# Altium project CW330_NewKintexFPGA.PrjPcb (part 2 of 5)

## Sheet CW340_PSU_VCCAUX.SchDoc: VCC-AUX/VCC-IO SMPS
size Letter; Organization: NewAE Technology Inc.; Address1: 1083 Queen St., Suite 196; Address2: Halifax; Address3: NS; Address4: Canada B3H 0B2; DocumentNumber: .; Revision: .; SheetNumber: 21; SheetTotal: 31; SheetApproved: YES
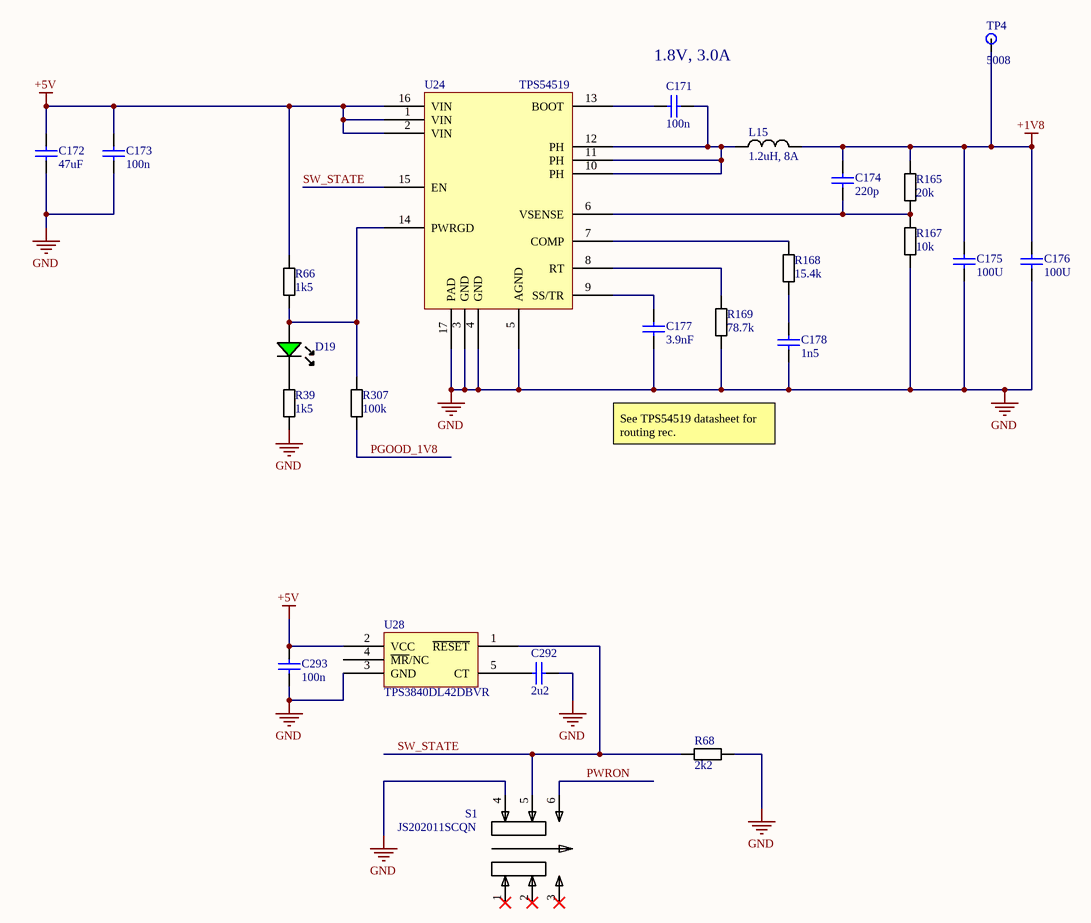
[diagram p8: CW340_PSU_VCCAUX.SchDoc]

### Parts
C171  100n  [CAPC0603_M]
C172  47uF  [CAPC3225X20N]
C173  100n  [CAPC0603_M]
C174  220p  [RESC1608X55N]
C175  100U  [CAPC1206_M]
C176  100U  [CAPC1206_M]
C177  3.9nF  [CAPC0603_M]
C178  1n5  [RESC1608X55N]
C292  2u2  [CAPC0603_M]
C293  100n  [CAPC0603_M]
D19  LED, 0603, Green  [LED-0603-GREEN]  (value not drawn)
L15  1.2uH, 8A  [XAL5030-122]
R39  1k5  [RESC1608X55N]
R66  1k5  [RESC1608X55N]
R68  2k2  [RESC1608X55N]
R165  20k  [RESC1608X55N]
R167  10k  [RESC1608X55N]
R168  15.4k  [RESC1608X55N]
R169  78.7k  [RESC1608X55N]
R307  100k  [RESC1608X55N]
S1  JS202011SCQN  [SW_JS202011SCQN]
TP4  5008  [KEYSTONE5008]
U24  TPS54519  [QFN50P300X300X80_HS-17N]
U28  TPS3840DL42DBVR  [SOT23-5P95_285X145L45X40]

### Nets
+1V8: C174.1 C175.1 C176.1 L15.2 R165.1 TP4.1
+5V: C172.1 C173.2 C293.2 R66.2 U24.1(VIN) U24.2(VIN) U24.16(VIN) U28.2(VCC)
GND: C172.2 C173.1 C175.2 C176.2 C177.2 C178.2 C292.2 C293.1 R39.2 R68.2 R167.2 R169.2 S1.4 U24.3(GND) U24.4(GND) U24.5(AGND) U24.17(PAD) U28.3(GND)
PGOOD_1V8: R307.2
PWRON: S1.6
SW_STATE: R68.1 S1.5 U24.15(EN) U28.1(~{RESET})
NetC171_1: C171.1 U24.13(BOOT)
NetC171_2: C171.2 L15.1 U24.10(PH) U24.11(PH) U24.12(PH)
NetC174_2: C174.2 R165.2 R167.1 U24.6(VSENSE)
NetC177_1: C177.1 U24.9(SS/TR)
NetC178_1: C178.1 R168.2
NetC292_1: C292.1 U28.5(CT)
NetD19_A: D19.A R66.1 R307.1 U24.14(PWRGD)
NetD19_K: D19.K R39.1
NetR168_1: R168.1 U24.7(COMP)
NetR169_1: R169.1 U24.8(RT)

Not connected (* = marked no-connect by the designer): S1 1* 2* 3*; U28 4(~{MR}/NC)

### Notes on the sheet
- (near C171) 1.8V, 3.0A
- See TPS54519 datasheet for routing rec.
- Title:
- Date:
- Rev:
- Time:
- Project:
- Sheet
- of
- License:
- Copyright © NewAE Technology Inc.
- Approved:
- NewAE.com
- File:

### Library data of the parts
C171 C173 C293 = CCHIP-100n-0603: 100n, 0603; Manufacture 1: Kemet; Manufacture Part Number 1: C0603C104K5RACTU; Component Group: Capacitor; Case-EIA: 0603; Case-Metric: 1608; Rated Voltage: 50VDC; Part Number: CCHIP-100n-0603; Footprint: 0603; Pin Count: 2; Supplier 1: Digi-Key; Supplier Part Number 1: 399-5089-2-ND; Value: 100n; Mounting Technology: SMT; Component Kind: Standard; Component Type: Standard
  C171 C173: LCSC Equivalent: C1591
C172 = CCHIP-47u-1210: 47u, 10V, 1210, Ceramic; Manufacture 1: TDK Corporation; Manufacture Part Number 1: C3225X5R1A476M250AC; Component Group: Capacitor; Case-EIA: 1210; Case-Metric: 3225; Rated Voltage: 10VDC; Tolerance: 20%; Part Number: CCHIP-47u-1210; Footprint: 1210; Pin Count: 2; Supplier 1: Digi-Key; Supplier Part Number 1: 445-6711-1-ND; Value: 47uF; Mounting Technology: SMT; Temperature Range: -55C to 85C; Component Kind: Standard; Component Type: Standard
C174 = CCHIP-220P-0603-250V: CAP CER 220PF 250V X7R 0603; Manufacture 1: Murata Electronics North America; Manufacture Part Number 1: GRM188R72E221KW07D; Component Group: Capacitor; Case-EIA: 0603; Case-Metric: 1608; Tolerance: ±10%; PP Material Stack: 0; Part Number: CCHIP-220P-0603-250V; Footprint: 0603; Pin Count: 2; Supplier 1: Digi-Key; Supplier Part Number 1: 490-3521-1-ND; Value: 220p; Rated Voltage: 250V; Mounting Technology: SMT; Component Kind: Standard; Component Type: Standard; PP Rotation: 0
C175 C176 = CCHIP-100u-1206-6.3v: CAP CER 100UF 6.3V X5R 1206; Manufacture 1: Murata Electronics; Manufacture Part Number 1: GRM31CR60J107ME39L; Component Group: Capacitor; Case-EIA: 1206; Case-Metric: 3216; Rated Voltage: 6.3VDC; Part Number: CCHIP-100u-1206-6.3v; Footprint: 1206; Pin Count: 2; Supplier 1: Digi-Key; Supplier Part Number 1: 490-4539-2-ND; Value: 100U; Mounting Technology: SMT; Component Kind: Standard; Component Type: Standard
C177 = CCHIP-3n9-0603: 3n9, 0603; Manufacture 1: Murata; Manufacture Part Number 1: GCM1885C1H392FA16J; Component Group: Capacitor; Case-EIA: 0603; Case-Metric: 1608; PP Material Stack: 0; Tolerance: 1%; Part Number: CCHIP-3n9-0603; Footprint: 0603; Pin Count: 2; Value: 3.9nF; Mounting Technology: SMT; Component Kind: Standard; Component Type: Standard; PP Rotation: 0; Supplier 1: Digi-Key; Supplier Part Number 1: 490-GCM1885C1H392FA16JCT-ND
C178 = CCHIP-1N5-0603-100V: CAP CER 1500PF 100V X7R 0603; Manufacture 1: Murata Electronics North America; Manufacture Part Number 1: GRM188R72A152KA01D; Component Group: Capacitor; Case-EIA: 0603; Case-Metric: 1608; Tolerance: ±10%; PP Material Stack: 0; Part Number: CCHIP-1N5-0603-100V; Footprint: 0603; Pin Count: 2; Supplier 1: Digi-Key; Supplier Part Number 1: 490-1475-1-ND; Value: 1n5; Rated Voltage: 100V; Mounting Technology: SMT; Component Kind: Standard; Component Type: Standard; PP Rotation: 0
C292 = CCHIP-2u2-0603: as C9 on sheet CW340_HEATSINK_FAN; Part Number: CCHIP-2u2-0603; Footprint: 0603; Pin Count: 2; Supplier 1: Digi-Key; Value: 2u2; Mounting Technology: SMT; Component Kind: Standard; Component Type: Standard; Supplier Part Number 1: 1276-1134-1-ND
D19 = LEDCHIP_0603_GREEN: Chip LED, Green; Manufacture 1: Kingbright; Manufacture Part Number 1: APT1608CGCK; Component Group: Optical; PP Material Stack: 16; PP Rotation: -90; Part Number: LEDCHIP_0603_GREEN; Pin Count: 2; Supplier 1: Digi-Key; Supplier Part Number 1: 754-1116-1-ND; Mounting Technology: SMT; Component Kind: Standard; Component Type: Standard
L15 = XAL5030-122: 1.2uH, 8A RMS, 12A SAT; Manufacture 1: Coilcraft; Manufacture Part Number 1: XAL5030-122MEB; Component Group: Inductor; PP Material Stack: 0; Part Number: XAL5030-122; Footprint: XAL5030; Pin Count: 2; Supplier 1: Mouser; Value: 1.2uH, 8A; Mounting Technology: SMT; Component Kind: Standard; Component Type: Standard; PP Rotation: 0
R39 R66 = RCHIP-1K5-0603: 1k5 res, 0603, 1%, 1/10W; Manufacture 1: Yageo; Manufacture Part Number 1: RC0603FR-071K5L; Component Group: Resistor; Case-EIA: 0603; Case-Metric: 1608; Rated Power: 0.1W; Rated Voltage: 75VDC; Part Number: RCHIP-1K5-0603; Footprint: 0603; Pin Count: 2; Supplier 1: Digi-Key; Supplier Part Number 1: 311-1.50KHRCT-ND; Value: 1k5; Tolerance: 1%; Mounting Technology: SMT; Temperature Range: -55C to 155C; Component Kind: Standard; Component Type: Standard
R68 = RCHIP-2K2-0603: 2k2 res, 0603, 1%, 1/10W; Manufacture 1: Yageo; Manufacture Part Number 1: RC0603FR-072K2L; Component Group: Resistor; Case-EIA: 0603; Case-Metric: 1608; Rated Power: 0.1W; Rated Voltage: 75VDC; Part Number: RCHIP-2K2-0603; Footprint: 0603; Pin Count: 2; Supplier 1: Digi-Key; Supplier Part Number 1: 311-2.20KHRCT-ND; Value: 2k2; Tolerance: 1%; Mounting Technology: SMT; Temperature Range: -55C to 155C; Component Kind: Standard; Component Type: Standard
R165 = RCHIP-20K-0603: 20k res, 0603, 1%, 1/10W; Manufacture 1: Yageo; Manufacture Part Number 1: RC0603FR-0720KL; Component Group: Resistor; Case-EIA: 0603; Case-Metric: 1608; Rated Power: 0.1W; Rated Voltage: 75VDC; Part Number: RCHIP-20K-0603; Footprint: 0603; Pin Count: 2; Supplier 1: Digi-Key; Supplier Part Number 1: 311-20.0KHRCT-ND; Value: 20k; Tolerance: 1%; Mounting Technology: SMT; Temperature Range: -55C to 155C; Component Kind: Standard; Component Type: Standard
R167 = RCHIP-10K-0603: 10k res, 0603, 1%, 1/10W; Manufacture 1: Yageo; Manufacture Part Number 1: RC0603FR-0710KL; Component Group: Resistor; Case-EIA: 0603; Case-Metric: 1608; Rated Power: 0.1W; Rated Voltage: 75VDC; Part Number: RCHIP-10K-0603; Footprint: 0603; Pin Count: 2; Supplier 1: Digi-Key; Supplier Part Number 1: 311-10.0KHRCT-ND; Value: 10k; Tolerance: 1%; Mounting Technology: SMT; Temperature Range: -55C to 155C; Component Kind: Standard; Component Type: Standard
R168 = RCHIP-15k4-0603: 15k4 res, 0603, 1%, 1/10W; Manufacture 1: Yageo; Manufacture Part Number 1: RC0603FR-0715K4L; Component Group: Resistor; Case-EIA: 0603; Case-Metric: 1608; Rated Power: 0.1W; Rated Voltage: 75VDC; Part Number: RCHIP-15k4-0603; Footprint: 0603; Pin Count: 2; Supplier 1: Digi-Key; Value: 15.4k; Tolerance: 1%; Mounting Technology: SMT; Temperature Range: -55C to 155C; Component Kind: Standard; Component Type: Standard; Supplier Part Number 1: 311-15.4KHRCT-ND
R169 = RCHIP-78k7-0603: 78k7 res, 0603, 1%, 1/10W; Manufacture 1: Yageo; Manufacture Part Number 1: RC0603FR-078K7L; Component Group: Resistor; Case-EIA: 0603; Case-Metric: 1608; Rated Power: 0.1W; Rated Voltage: 75VDC; Part Number: RCHIP-78k7-0603; Footprint: 0603; Pin Count: 2; Supplier 1: Digi-Key; Value: 78.7k; Tolerance: 1%; Mounting Technology: SMT; Temperature Range: -55C to 155C; Component Kind: Standard; Component Type: Standard; Supplier Part Number 1: 311-78.7KHRCT-ND
R307 = RCHIP-100K-0603: as R149 on sheet CW340_INPUT_POWER; Part Number: RCHIP-100K-0603; Footprint: 0603; Pin Count: 2; Supplier 1: Digi-Key; Supplier Part Number 1: 311-100KHRCT-ND; Value: 100k; Tolerance: 1%; Mounting Technology: SMT; Temperature Range: -55C to 155C; Component Kind: Standard; Component Type: Standard
S1 = JS202011SCQN: DPDT SMD Switch, 300mA; Manufacture 1: C&K Components; Part Number: JS202011SCQN; Component Group: Switch; Manufacture Part Number 1: JS202011SCQN; Pin Count: 6; Supplier 1: Digi-Key; Supplier Part Number 1: 401-2002-1-ND; Value: DPDT; Mounting Technology: SMT; Component Kind: Standard; Component Type: Standard
TP4 = KEYSTONE_5008: TEST POINT PC COMPACT .063"D ORG; Part Number: KEYSTONE_5008; Component Group: Test Point; Pin Count: 1; Supplier 1: Digi-Key; Supplier Part Number 1: 36-5008-ND; Mounting Technology: Through-hole; Component Kind: Standard; Component Type: Standard
U24 = TPS54519: 6V Input, 5A, SMPS; Manufacture 1: Texas Instruments; Component Group: Analog IC; PP Material Stack: 0; Part Number: TPS54519; Footprint: 16-QFN; Manufacture Part Number 1: TPS54519; Pin Count: 17; Component Kind: Standard; Component Type: Standard; PP Rotation: 0; Mounting Technology: SMT
U28 = TPS3840DL42DBVR: Reset Supervisor; Manufacture 1: Texas Instruments; Component Group: Analog IC; PP Material Stack: 0; Part Number: TPS3840DL42DBVR; Footprint: SOT25; Manufacture Part Number 1: TPS3840DL42DBVR; Pin Count: 5; Supplier 1: Digi-Key; Supplier Part Number 1: TPS3840DL42DBVRCT-ND; Mounting Technology: SMT; RoHS: Yes; Component Kind: Standard; Component Type: Standard; PP Rotation: 0

## Sheet CW340_USBHUB.SchDoc: USB Hub
size Letter; Organization: NewAE Technology Inc.; Address1: 1083 Queen St., Suite 196; Address2: Halifax; Address3: NS; Address4: Canada B3H 0B2; DocumentNumber: .; Revision: .; SheetNumber: 6; SheetTotal: 31; SheetApproved: YES
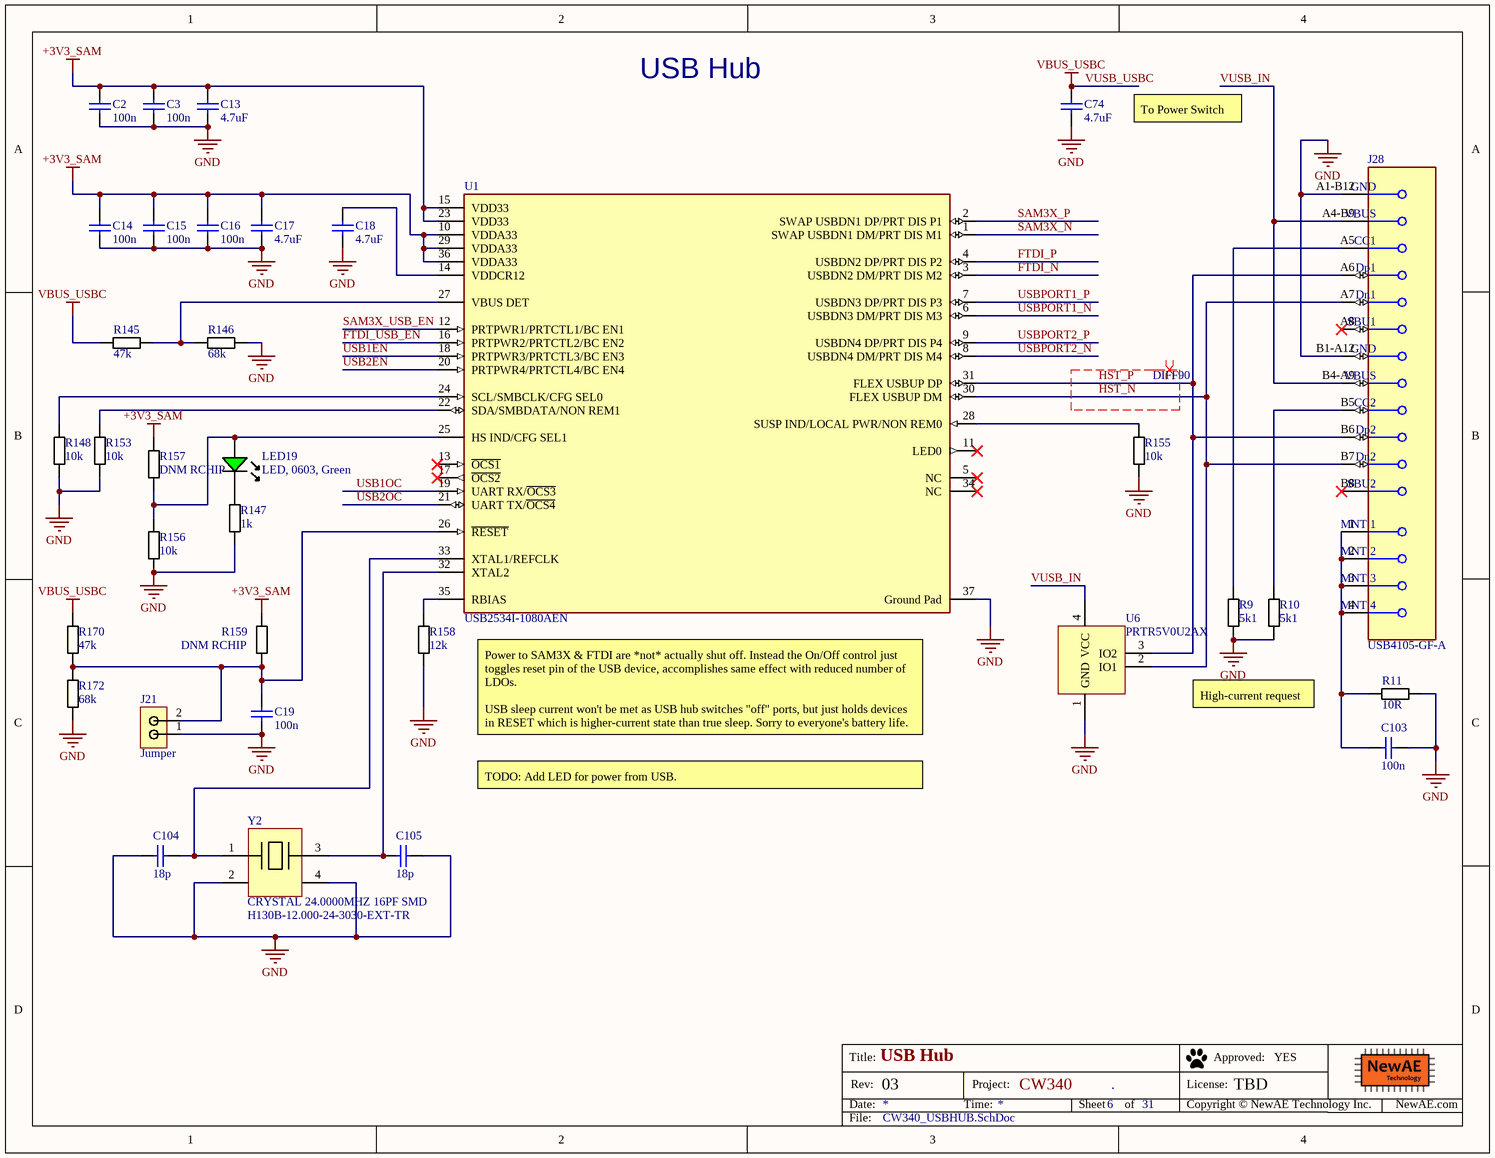
[diagram p9: CW340_USBHUB.SchDoc]

### Parts
C2  100n  [CAPC0402_M]
C3  100n  [CAPC0402_M]
C13  4.7uF  [CAPC0805_M]
C14  100n  [CAPC0402_M]
C15  100n  [CAPC0402_M]
C16  100n  [CAPC0402_M]
C17  4.7uF  [CAPC0805_M]
C18  4.7uF  [CAPC0805_M]
C19  100n  [CAPC0402_M]
C74  4.7uF  [CAPC0805_M]
C103  100n  [CAPC0603_M]
C104  18p  [CAPC0402_M]
C105  18p  [CAPC0402_M]
J21  Jumper  [2x2.54mm_Header]
J28  USB4105-GF-A  [FP-USB4105-GF-A-MFG]
LED19  LED, 0603, Green  [LED-0603-GREEN]
R9  5k1  [RESC1608X55N]
R10  5k1  [RESC1608X55N]
R11  10R  [RESC1608X55N]
R145  47k  [RESC1608X55N]
R146  68k  [RESC1608X55N]
R147  1k  [RESC1608X55N]
R148  10k  [RESC1608X55N]
R153  10k  [RESC1608X55N]
R155  10k  [RESC1608X55N]
R156  10k  [RESC1608X55N]
R157  DNM RCHIP  [RESC1608X55N]
R158  12k  [RESC1608X55N]
R159  DNM RCHIP  [RESC1608X55N]
R170  47k  [RESC1608X55N]
R172  68k  [RESC1608X55N]
U1  USB2534I-1080AEN  [FP-36SQFN-3706-6x6B-IPC_C]
U6  PRTR5V0U2AX  [SOT143B]
Y2  CRYSTAL 24.0000MHZ 16PF SMD  Manufacturer Part Number: H130B-12.000-24-3030-EXT-TR  [5x3.2MM XTAL]

### Nets
+3V3_SAM: C2.1 C3.1 C13.1 C14.1 C15.1 C16.1 C17.1 R157.1 R159.1 U1.10(VDDA33) U1.15(VDD33) U1.23(VDD33) U1.29(VDDA33) U1.36(VDDA33)  [project net +3V3_SAM_VDDANA]
GND: C2.2 C3.2 C13.2 C14.2 C15.2 C16.2 C17.2 C18.1 C19.2 C74.2 C103.2 C104.1 C105.2 J21.1 J28.A1-B12(GND) J28.B1-A12(GND) R9.2 R10.2 R11.2 R146.2 R147.2 R148.1 R153.1 R155.1 R156.2 R158.2 R172.1 U1.37(Ground_Pad) U6.1(GND) Y2.2 Y2.4
VUSB_USBC: C74.1 R145.1 R170.1  [also labelled VBUS_USBC]
FTDI_N: U1.3(USBDN2_DM/PRT_DIS_M2)
FTDI_P: U1.4(USBDN2_DP/PRT_DIS_P2)
FTDI_USB_EN: U1.16(PRTPWR2/PRTCTL2/BC_EN2)
HST_N: J28.A7(Dn1) J28.B7(Dn2) U1.30(FLEX_USBUP_DM) U6.2(IO1)
HST_P: J28.A6(Dp1) J28.B6(Dp2) U1.31(FLEX_USBUP_DP) U6.3(IO2)
SAM3X_N: U1.1(SWAP_USBDN1_DM/PRT_DIS_M1)
SAM3X_P: U1.2(SWAP_USBDN1_DP/PRT_DIS_P1)
SAM3X_USB_EN: U1.12(PRTPWR1/PRTCTL1/BC_EN1)
USB1EN: U1.18(PRTPWR3/PRTCTL3/BC_EN3)
USB1OC: U1.19(UART_RX/~{OCS3})
USB2EN: U1.20(PRTPWR4/PRTCTL4/BC_EN4)
USB2OC: U1.21(UART_TX/~{OCS4})
USBPORT1_N: U1.6(USBDN3_DM/PRT_DIS_M3)
USBPORT1_P: U1.7(USBDN3_DP/PRT_DIS_P3)
USBPORT2_N: U1.8(USBDN4_DM/PRT_DIS_M4)
USBPORT2_P: U1.9(USBDN4_DP/PRT_DIS_P4)
VUSB_IN: J28.A4-B9(VBUS) J28.B4-A9(VBUS) U6.4(VCC)
NetC18_2: C18.2 U1.14(VDDCR12)
NetC19_1: C19.1 J21.2 R159.2 R170.2 R172.2 U1.26(~{RESET})
NetC103_1: C103.1 J28.1(MNT_1) J28.2(MNT_2) J28.3(MNT_3) J28.4(MNT_4) R11.1
NetC104_2: C104.2 U1.33(XTAL1/REFCLK) Y2.1
NetC105_1: C105.1 U1.32(XTAL2) Y2.3
NetJ28_A5: J28.A5(CC1) R9.1
NetJ28_B5: J28.B5(CC2) R10.1
NetLED19_A: LED19.A R156.1 R157.2 U1.25(HS_IND/CFG_SEL1)
NetLED19_K: LED19.K R147.1
NetR145_2: R145.2 R146.1 U1.27(VBUS_DET)
NetR148_2: R148.2 U1.24(SCL/SMBCLK/CFG_SEL0)
NetR153_2: R153.2 U1.22(SDA/SMBDATA/NON_REM1)
NetR155_2: R155.2 U1.28(SUSP_IND/LOCAL_PWR/NON_REM0)
NetR158_1: R158.1 U1.35(RBIAS)

Not connected (* = marked no-connect by the designer): J28 A8(SBU1)* B8(SBU2)*; U1 5(NC)* 11(LED0)* 13(~{OCS1})* 17(~{OCS2})* 34(NC)*

### Layout directives
differential pair; differential pair class DIFF90: HST_N, HST_P

### Notes on the sheet
- USB Hub
- To Power Switch
- High-current request
- Power to SAM3X & FTDI are *not* actually shut off. Instead the On/Off control just toggles reset pin of the USB device, accomplishes same effect with reduced number of LDOs.
  USB sleep current won't be met as USB hub switches "off" ports, but just holds devices in RESET which is higher-current state than true sleep. Sorry to everyone's battery life.
- TODO: Add LED for power from USB.
- Title:
- Date:
- Rev:
- Time:
- Project:
- Sheet
- of
- License:
- Copyright © NewAE Technology Inc.
- Approved:
- NewAE.com
- File:

### Library data of the parts
C2 C3 C14-C16 C19 = CCHIP-100n-0402: as C28 on sheet CW340_Clocks; Part Number: CCHIP-100n-0402; Footprint: 0402; Pin Count: 2; Value: 100n; Mounting Technology: SMT; Component Kind: Standard; Component Type: Standard; Supplier 1: Digi-Key; Supplier Part Number 1: 445-6901-1-ND
C13 C17 C18 C74 = CCHIP-4u7-0805-35V: 4u7, 35V, 0805, Ceramic; Manufacture 1: Murata; Manufacture Part Number 1: GRT21BC8YA475KE13L; Component Group: Capacitor; Case-EIA: 0805; Case-Metric: 1608; Rated Voltage: 35VDC; Tolerance: 10%; Part Number: CCHIP-4u7-0805-35V; Footprint: 0805; Pin Count: 2; Supplier 1: Digi-Key; Supplier Part Number 1: 490-12361-1-ND; Value: 4.7uF; Mounting Technology: SMT; Temperature Range: -55C to 85C; Component Kind: Standard; Component Type: Standard
C103 = CCHIP-100n-0603: as C171 on sheet CW340_PSU_VCCAUX; Part Number: CCHIP-100n-0603; Footprint: 0603; Pin Count: 2; Supplier 1: Digi-Key; Supplier Part Number 1: 399-5089-2-ND; Value: 100n; Mounting Technology: SMT; Component Kind: Standard; Component Type: Standard
C104 C105 = CCHIP-18p-0402: 18p, 0402; Manufacture Part Number 1: GRM1555C1H180JA01D; Component Group: Capacitor; Case-EIA: 0402; Part Number: CCHIP-18p-0402; Footprint: 0402; Pin Count: 2; Supplier 1: Digi-Key; Supplier Part Number 1: 490-5858-1-ND; Value: 18p; Mounting Technology: SMT; Component Kind: Standard; Component Type: Standard
J21 = 2_PIN_JUMPER: 1x2 2.54mm header, male pins; Manufacture 1: Harwin; Manufacture Part Number 1: M20-9990246; Component Group: PCB Feature; PP Material Stack: 0; Part Number: 2_PIN_JUMPER; Pin Count: 2; Supplier 1: Digi-Key; Supplier Part Number 1: 952-2262-ND; Mounting Technology: Through-hole; RoHS: Yes; Component Kind: Standard; Component Type: Standard; PP Rotation: 0
J28 = CMP-245163-000001-1: CONN RCPT USB2.0 TYPEC 5A; Manufacturer: GCT; Voltage Rating: 20V; Is Female: yes; Current Rating: 5/6.25/1.25/0.25A; Number Of Contacts: 16; Conn Orientation: Right Angle; Device Class L1: Connectors; Category: Conn; Lead Free: Yes; RoHS: TRUE; Temperature Range High: +85°C; Digikey Description: CONN RCPT USB2.0 TYPEC 5A; Device Class L3: unset; ComponentLink2Description: Datasheet; Manufacturer Part Number: USB4105-GF-A; Package: 0; Usb Standard: USB 2.0; Device Class L2: USB Connectors; Automotive: No; Temperature Range Low: -40°C; Height: 3.46mm; Temperature: -40°C to +85°C; Contact Material: Gold,Nickel; ComponentLink2URL: https://gct.co/files/drawings/usb4105.pdf; Octopart: https://octopart.com/usb4105-gf-a-gct-106627878
LED19 = LEDCHIP_0603_GREEN: as D19 on sheet CW340_PSU_VCCAUX; Part Number: LEDCHIP_0603_GREEN; Pin Count: 2; Supplier 1: Digi-Key; Supplier Part Number 1: 754-1116-1-ND; Mounting Technology: SMT; Component Kind: Standard; Component Type: Standard
R9 R10 = RCHIP-5K1-0603: 5k1 res, 0603, 1%, 1/10W; Manufacture 1: Yageo; Manufacture Part Number 1: RC0603FR-075K1L; Component Group: Resistor; Case-EIA: 0603; Case-Metric: 1608; Rated Power: 0.1W; Rated Voltage: 75VDC; Part Number: RCHIP-5K1-0603; Footprint: 0603; Pin Count: 2; Supplier 1: Digi-Key; Supplier Part Number 1: 311-5.10KHRCT-ND; Value: 5k1; Tolerance: 1%; Mounting Technology: SMT; Temperature Range: -55C to 155C; Component Kind: Standard; Component Type: Standard
R11 = RCHIP-10R-0603: 10R res, 0603, 1%, 1/10W; Manufacture 1: Yageo; Manufacture Part Number 1: RC0603FR-0710RL; Component Group: Resistor; Case-EIA: 0603; Case-Metric: 1608; Rated Power: 0.1W; Rated Voltage: 75VDC; Part Number: RCHIP-10R-0603; Footprint: 0603; Pin Count: 2; Supplier 1: Digi-Key; Supplier Part Number 1: 311-10.0HRCT-ND; Value: 10R; Tolerance: 1%; Mounting Technology: SMT; Temperature Range: -55C to 155C; Component Kind: Standard; Component Type: Standard
R145 R170 = RCHIP-47K-0603: 47k res, 0603, 1%, 1/10W; Manufacture 1: Yageo; Manufacture Part Number 1: RC0603FR-0747KL; Component Group: Resistor; Case-EIA: 0603; Case-Metric: 1608; Rated Power: 0.1W; Rated Voltage: 75VDC; Part Number: RCHIP-47K-0603; Footprint: 0603; Pin Count: 2; Supplier 1: Digi-Key; Supplier Part Number 1: 311-47.0KHRCT-ND; Value: 47k; Tolerance: 1%; Mounting Technology: SMT; Temperature Range: -55C to 155C; Component Kind: Standard; Component Type: Standard
R146 R172 = RCHIP-68K-0603: 68k res, 0603, 1%, 1/10W; Manufacture 1: Yageo; Manufacture Part Number 1: RC0603FR-0768KL; Component Group: Resistor; Case-EIA: 0603; Case-Metric: 1608; Rated Power: 0.1W; Rated Voltage: 75VDC; Part Number: RCHIP-68K-0603; Footprint: 0603; Pin Count: 2; Supplier 1: Digi-Key; Supplier Part Number 1: 311-68.0KHRCT-ND; Value: 68k; Tolerance: 1%; Mounting Technology: SMT; Temperature Range: -55C to 155C; Component Kind: Standard; Component Type: Standard
R147 = RCHIP-1K-0603: 1k res, 0603, 1%, 1/10W; Manufacture 1: Yageo; Manufacture Part Number 1: RC0603FR-071KL; Component Group: Resistor; Case-EIA: 0603; Case-Metric: 1608; Rated Power: 0.1W; Rated Voltage: 75VDC; Part Number: RCHIP-1K-0603; Footprint: 0603; Pin Count: 2; Supplier 1: Digi-Key; Supplier Part Number 1: 311-1.00KHRCT-ND; Value: 1k; Tolerance: 1%; Mounting Technology: SMT; Temperature Range: -55C to 155C; Component Kind: Standard; Component Type: Standard
R148 R153 R155 = RCHIP-10K-0603: as R167 on sheet CW340_PSU_VCCAUX; Part Number: RCHIP-10K-0603; Footprint: 0603; Pin Count: 2; Supplier 1: Digi-Key; Supplier Part Number 1: 311-10.0KHRCT-ND; Value: 10k; Tolerance: 1%; Mounting Technology: SMT; Temperature Range: -55C to 155C; Component Kind: Standard; Component Type: Standard
R156 = RCHIP-10k-0603: 10k res, 0603, 1%, 1/10W; Manufacture 1: Yageo; Manufacture Part Number 1: RC0603FR-0710KL; Component Group: Resistor; Case-EIA: 0603; Case-Metric: 1608; Rated Power: 0.1W; Rated Voltage: 75VDC; Part Number: RCHIP-10K-0603; Footprint: 0603; Pin Count: 2; Mounting Technology: SMT; Component Kind: Standard; Component Type: Standard; Supplier 1: Digi-Key; Supplier Part Number 1: 311-10.0KHRCT-ND; Value: 10k; Tolerance: 1%; Temperature Range: -55C to 155C
R157 R159 = RCHIP-DNM-0603: Do Not Mount Resistor; Case-EIA: 0603; Case-Metric: 1608; Part Number: RCHIP-DNM-0603; Component Group: Resistor; Footprint: 0603; Pin Count: 2; Mounting Technology: SMT; Component Kind: Standard; Component Type: Standard
R158 = RCHIP-12K-0603: 12k res, 0603, 1%, 1/10W; Manufacture 1: Yageo; Manufacture Part Number 1: RC0603FR-0712KL; Component Group: Resistor; Case-EIA: 0603; Case-Metric: 1608; Rated Power: 0.1W; Rated Voltage: 75VDC; Part Number: RCHIP-12K-0603; Footprint: 0603; Pin Count: 2; Supplier 1: Digi-Key; Supplier Part Number 1: 311-12.0KHRCT-ND; Value: 12k; Tolerance: 1%; Mounting Technology: SMT; Temperature Range: -55C to 155C; Component Kind: Standard; Component Type: Standard
U1 = CMP-06284-000029-1: IC USB 2.0 HUB CTLR 4PORT 36SQFN; Max Supply Voltage: 3.6V; Operating Supply Voltage: 3.3V; Number of Ports: 4; ESD Protection: Yes; Interface: I2C; Number of Transceivers: 1; Min Supply Voltage: 3V; Radiation Hardening: No; Packaging: Tray; Height: 0.95mm; Package Quantity: 490; Min Operating Temperature: -40°C; REACH SVHC: No SVHC; Lead Free: Lead Free; Mount: Surface Mount; Number of Channels: 4; Max Operating Temperature: 85°C; Width: 6.1mm; Number of Pins: 36; RoHS Compliant: Yes; Length: 6.1mm
U6 = PRTR5V0U2AX: USB 2.0 high-speed ESD; Component Group: Diode; Supplier 1: Digi-Key; Supplier Part Number 1: 568-7445-1-ND; Part Number: PRTR5V0U2AX; Pin Count: 4; Component Kind: Standard; Component Type: Standard; 0_TEMP: SOT143B
Y2 = H130B-24.000-18-3030-EXT-TR: 24MHz ±30ppm Crystal 16pF 35 Ohms 4-SMD, No Lead; Manufacturer: Raltron Electronics; Value: 12.000MHz; PP Material Stack: 0; Supplier 1: Digi-Key; RoHS: No; Stock 1: 4955; Pricing 1: 1=0.590000, 10=0.488000, 50=0.439400, 100=0.390600, 500=0.371100 (USD); Supplier Part Number 1: 2151-H130B-24.000-18-3030-EXT-TRCT-ND; .Checked SCH: *; .Checked PCB: *; Part Number: H130B-24.000-18-3030-EXT-TR; Component Group: Crystal; Footprint: 5x3.2mm; Manufacture 1: Raltron Electronics; Manufacture Part Number 1: H130B-24.000-18-3030-EXT-TR; Pin Count: 4; Mounting Technology: SMT; Component Kind: Standard; Component Type: Standard; PP Rotation: 0

## Sheet CW340_USBHUB_ExtPorts.SchDoc: USB Hub Downstream
size A4
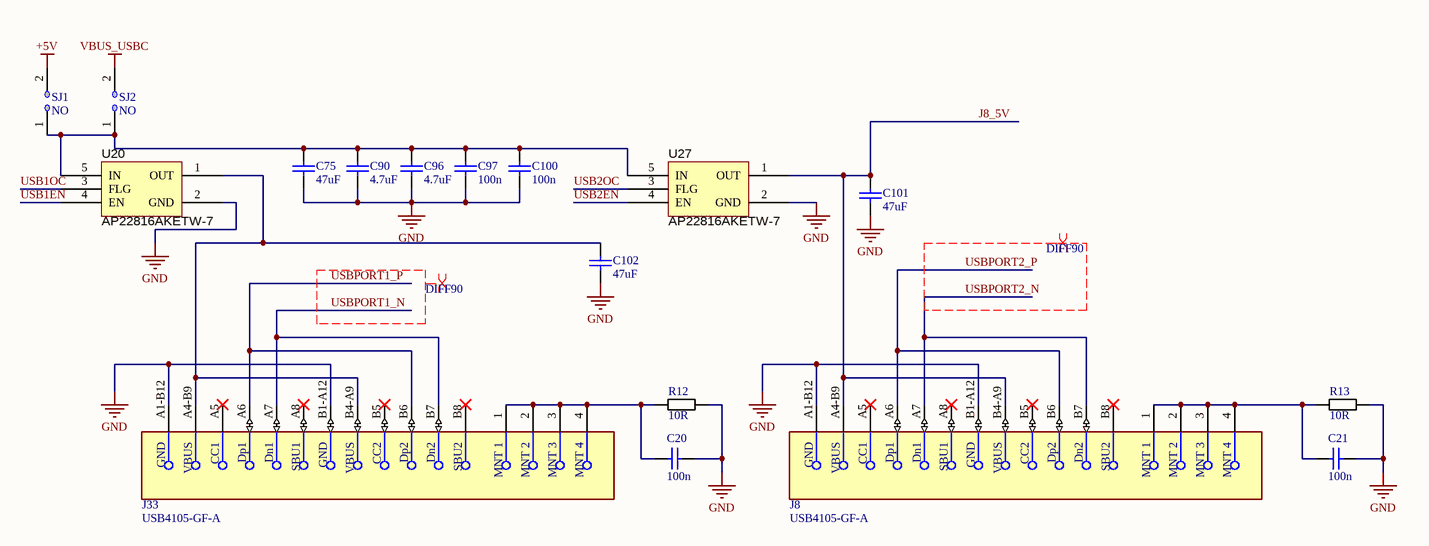
[diagram p10: CW340_USBHUB_ExtPorts.SchDoc]

### Parts
C20  100n  [CAPC0603_M]
C21  100n  [CAPC0603_M]
C75  47uF  [CAPC3225X20N]
C90  4.7uF  [CAPC0805_M]
C96  4.7uF  [CAPC0805_M]
C97  100n  [CAPC0402_M]
C100  100n  [CAPC0402_M]
C101  47uF  [CAPC3225X20N]
C102  47uF  [CAPC3225X20N]
J8  USB4105-GF-A  [FP-USB4105-GF-A-MFG]
J33  USB4105-GF-A  [FP-USB4105-GF-A-MFG]
R12  10R  [RESC1608X55N]
R13  10R  [RESC1608X55N]
SJ1  NO  [SJ_2S_NO]  (no BOM)
SJ2  NO  [SJ_2S_NO]  (no BOM)
U20  AP22816AKETW-7  [SOT23-5P95_285X145L45X40]
U27  AP22816AKETW-7  [SOT23-5P95_285X145L45X40]

### Nets
+5V: SJ1.2
GND: C20.2 C21.2 C75.2 C90.2 C96.2 C97.2 C100.2 C101.2 C102.2 J8.A1-B12(GND) J8.B1-A12(GND) J33.A1-B12(GND) J33.B1-A12(GND) R12.2 R13.2 U20.2(GND) U27.2(GND)
VBUS_USBC: SJ2.2  [project net VUSB_USBC]
J8_5V: C101.1 J8.A4-B9(VBUS) J8.B4-A9(VBUS) U27.1(OUT)
USB1EN: U20.4(EN)
USB1OC: U20.3(FLG)
USB2EN: U27.4(EN)
USB2OC: U27.3(FLG)
USBPORT1_N: J33.A7(Dn1) J33.B7(Dn2)
USBPORT1_P: J33.A6(Dp1) J33.B6(Dp2)
USBPORT2_N: J8.A7(Dn1) J8.B7(Dn2)
USBPORT2_P: J8.A6(Dp1) J8.B6(Dp2)
NetC20_1: C20.1 J33.1(MNT_1) J33.2(MNT_2) J33.3(MNT_3) J33.4(MNT_4) R12.1
NetC21_1: C21.1 J8.1(MNT_1) J8.2(MNT_2) J8.3(MNT_3) J8.4(MNT_4) R13.1
NetC75_1: C75.1 C90.1 C96.1 C97.1 C100.1 SJ1.1 SJ2.1 U20.5(IN) U27.5(IN)
NetC102_1: C102.1 J33.A4-B9(VBUS) J33.B4-A9(VBUS) U20.1(OUT)

Not connected (* = marked no-connect by the designer): J8 A5(CC1)* A8(SBU1)* B5(CC2)* B8(SBU2)*; J33 A5(CC1)* A8(SBU1)* B5(CC2)* B8(SBU2)*

### Layout directives
differential pair; differential pair class DIFF90: USBPORT1_N, USBPORT1_P, USBPORT2_N, USBPORT2_P

### Library data of the parts
C20 C21 = CCHIP-100n-0603: as C171 on sheet CW340_PSU_VCCAUX; Part Number: CCHIP-100n-0603; Footprint: 0603; Pin Count: 2; Supplier 1: Digi-Key; Supplier Part Number 1: 399-5089-2-ND; Value: 100n; Mounting Technology: SMT; Component Kind: Standard; Component Type: Standard
C75 C101 C102 = CCHIP-47u-1210: as C172 on sheet CW340_PSU_VCCAUX; Part Number: CCHIP-47u-1210; Footprint: 1210; Pin Count: 2; Supplier 1: Digi-Key; Supplier Part Number 1: 445-6711-1-ND; Value: 47uF; Mounting Technology: SMT; Temperature Range: -55C to 85C; Component Kind: Standard; Component Type: Standard
C90 C96 = CCHIP-4u7-0805-35V: as C13 on sheet CW340_USBHUB; Part Number: CCHIP-4u7-0805-35V; Footprint: 0805; Pin Count: 2; Supplier 1: Digi-Key; Supplier Part Number 1: 490-12361-1-ND; Value: 4.7uF; Mounting Technology: SMT; Temperature Range: -55C to 85C; Component Kind: Standard; Component Type: Standard
C97 C100 = CCHIP-100n-0402: as C28 on sheet CW340_Clocks; Part Number: CCHIP-100n-0402; Footprint: 0402; Pin Count: 2; Value: 100n; Mounting Technology: SMT; Component Kind: Standard; Component Type: Standard; Supplier 1: Digi-Key; Supplier Part Number 1: 445-6901-1-ND
J8 J33 = CMP-245163-000001-1: as J28 on sheet CW340_USBHUB; Device Class L1: Connectors; Category: Conn; Lead Free: Yes; RoHS: TRUE; Temperature Range High: +85°C; Digikey Description: CONN RCPT USB2.0 TYPEC 5A; Device Class L3: unset; ComponentLink2Description: Datasheet; Manufacturer Part Number: USB4105-GF-A; Package: 0; Usb Standard: USB 2.0; Device Class L2: USB Connectors; Automotive: No; Temperature Range Low: -40°C; Height: 3.46mm; Temperature: -40°C to +85°C; Contact Material: Gold,Nickel; ComponentLink2URL: https://gct.co/files/drawings/usb4105.pdf; Octopart: https://octopart.com/usb4105-gf-a-gct-106627878
R12 R13 = RCHIP-10R-0603: as R11 on sheet CW340_USBHUB; Part Number: RCHIP-10R-0603; Footprint: 0603; Pin Count: 2; Supplier 1: Digi-Key; Supplier Part Number 1: 311-10.0HRCT-ND; Value: 10R; Tolerance: 1%; Mounting Technology: SMT; Temperature Range: -55C to 155C; Component Kind: Standard; Component Type: Standard
SJ1 SJ2 = SJ_2S_NO: Solder Jumper, NO; Component Group: PCB Feature; Part Number: SJ_2S_NO; Pin Count: 2; Mounting Technology: COPPER; Component Type: Standard (No BOM)
U20 U27 = AP22816AKE: USB Power Switch, Digital IC; Manufacture 1: Diodes Inc; Manufacture Part Number 1: AP22816AKEWT-7; Company_PN: <Enter Company P/N>; Component Group: Analog IC; PP Material Stack: 0; Created By: D.GODDARD; Part Number: AP22816AKE; Footprint: SOT25; Pin Count: 5; Supplier 1: Mouser; Supplier Part Number 1: AP22816AKEWT-7; Mounting Technology: SMT; Component Kind: Standard; Component Type: Standard; PP Rotation: 0

## Sheet CW340_SAM3X_MAIN.SchDoc: Control MCU Main
size Letter; Organization: NewAE Technology Inc.; Address1: 1083 Queen St., Suite 196; Address2: Halifax; Address3: NS; Address4: Canada B3H 0B2; DocumentNumber: .; Revision: .; SheetNumber: 5; SheetTotal: 31; SheetApproved: No
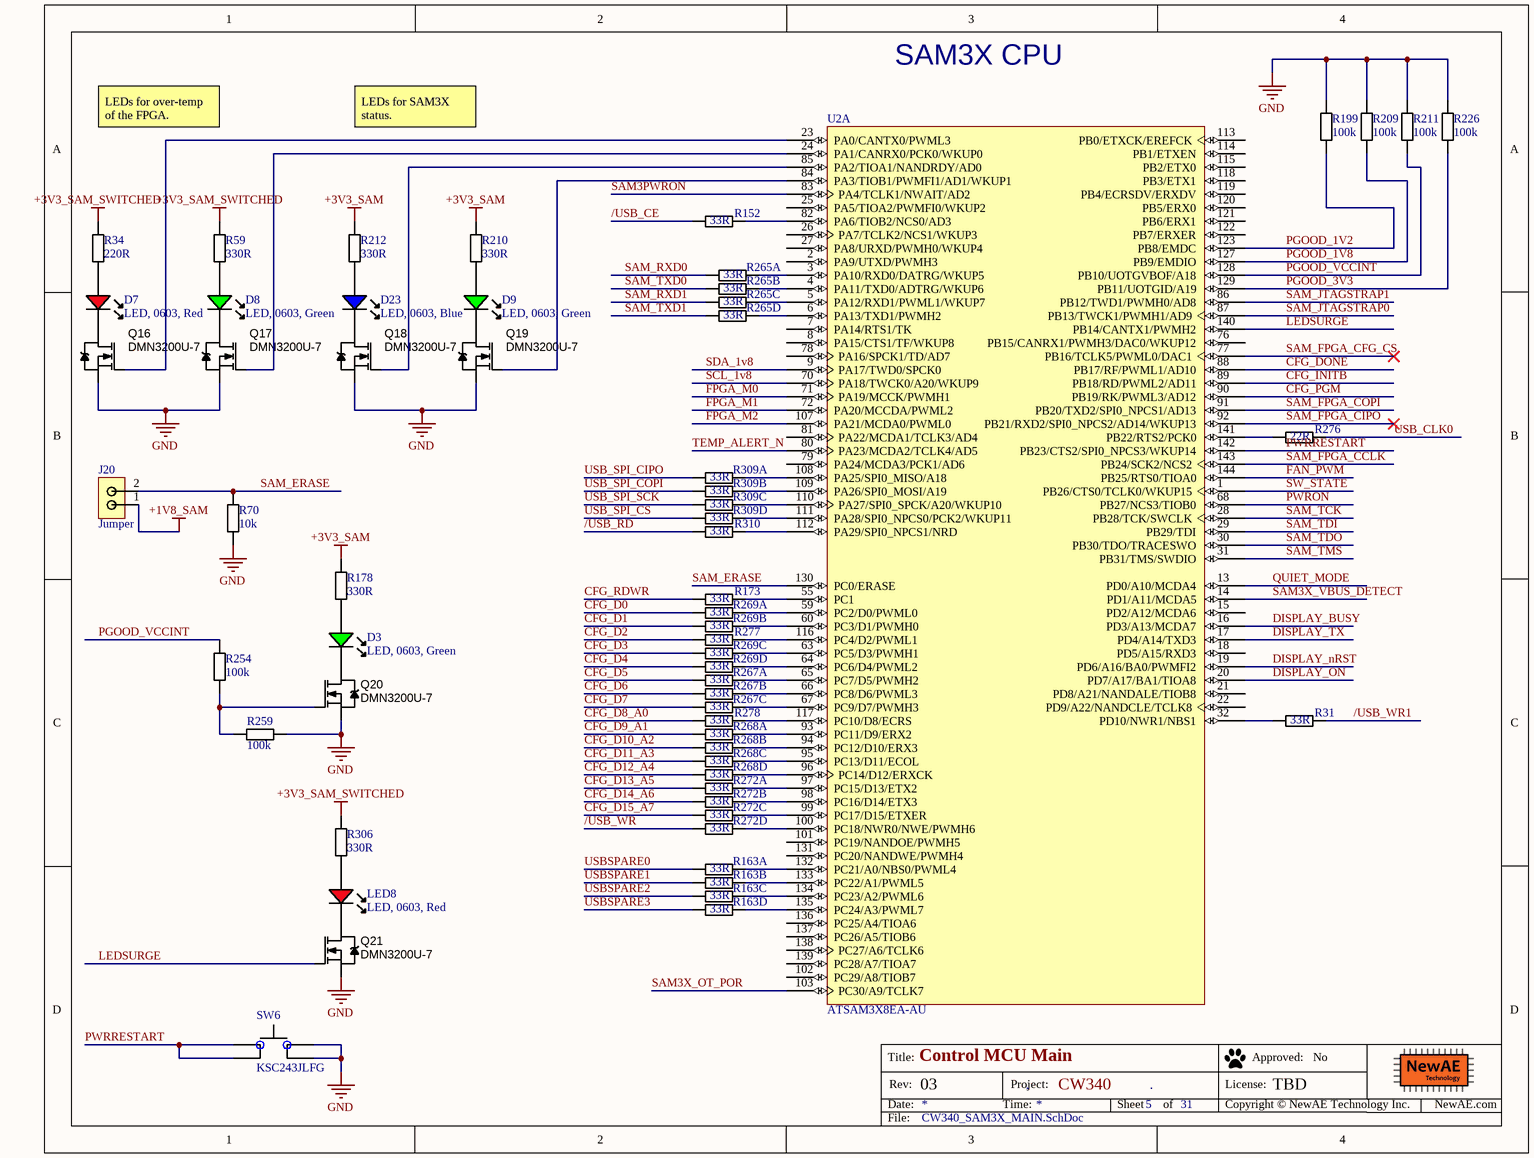
[diagram p11: CW340_SAM3X_MAIN.SchDoc]

### Parts
D3  LED, 0603, Green  [LED-0603-GREEN]
D7  LED, 0603, Red  [LED-0603-RED]
D8  LED, 0603, Green  [LED-0603-GREEN]
D9  LED, 0603, Green  [LED-0603-GREEN]
D23  LED, 0603, Blue  [LED-0603-BLUE]
J20  Jumper  [2x2.54mm_Header]
LED8  LED, 0603, Red  [LED-0603-RED]
Q16  DMN3200U-7  [SOT95P245X110-3M]
Q17  DMN3200U-7  [SOT95P245X110-3M]
Q18  DMN3200U-7  [SOT95P245X110-3M]
Q19  DMN3200U-7  [SOT95P245X110-3M]
Q20  DMN3200U-7  [SOT95P245X110-3M]
Q21  DMN3200U-7  [SOT95P245X110-3M]
R31  33R  [RESC1005X40N]
R34  220R  [RESC1608X55N]
R59  330R  [RESC1608X55N]
R70  10k  [RESC1005X40N]
R152  33R  [RESC1005X40N]
R163  33R  [741C083]  (parts A,B,C,D of 4)
R173  33R  [RESC1005X40N]
R178  330R  [RESC1608X55N]
R199  100k  [RESC1608X55N]
R209  100k  [RESC1608X55N]
R210  330R  [RESC1608X55N]
R211  100k  [RESC1608X55N]
R212  330R  [RESC1608X55N]
R226  100k  [RESC1608X55N]
R254  100k  [RESC1608X55N]
R259  100k  [RESC1608X55N]
R265  33R  [741C083]  (parts A,B,C,D of 4)
R267  33R  [741C083]  (parts A,B,C of 4)
R268  33R  [741C083]  (parts A,B,C,D of 4)
R269  33R  [741C083]  (parts A,B,C,D of 4)
R272  33R  [741C083]  (parts A,B,C,D of 4)
R276  22R  [RESC1005X40N]
R277  33R  [RESC1005X40N]
R278  33R  [RESC1005X40N]
R306  330R  [RESC1608X55N]
R309  33R  [741C083]  (parts A,B,C,D of 4)
R310  33R  [RESC1005X40N]
SW6  KSC243JLFG  [CK_KSC2J]
U2  ATSAM3X8EA-AU  [LQFP144_L]  (part A of 3)

### Nets
+1V8_SAM: J20.1  [project net +1V8_SAM_VDDBU]
+3V3_SAM: R178.2 R210.2 R212.2  [project net +3V3_SAM_VDDANA]
+3V3_SAM_SWITCHED: R34.2 R59.2 R306.2
GND: Q16.2(S) Q17.2(S) Q18.2(S) Q19.2(S) Q20.2(S) Q21.2(S) R70.2 R199.1 R209.1 R211.1 R226.1 R259.2 SW6.2(IN) SW6.3(IN)
/USB_CE: R152.1
/USB_RD: R310.1
/USB_WR: R272.4A
/USB_WR1: R31.2
CFG_D0: R269.1A
CFG_D1: R269.2A
CFG_D2: R277.1
CFG_D3: R269.3A
CFG_D4: R269.4A
CFG_D5: R267.1A
CFG_D6: R267.2A
CFG_D7: R267.3A
CFG_D8_A0: R278.1
CFG_D9_A1: R268.1A
CFG_D10_A2: R268.2A
CFG_D11_A3: R268.3A
CFG_D12_A4: R268.4A
CFG_D13_A5: R272.1A
CFG_D14_A6: R272.2A
CFG_D15_A7: R272.3A
CFG_DONE: U2.88(PB17/RF/PWML1/AD10)
CFG_INITB: U2.89(PB18/RD/PWML2/AD11)
CFG_PGM: U2.90(PB19/RK/PWML3/AD12)
CFG_RDWR: R173.1
DISPLAY_BUSY: U2.16(PD3/A13/MCDA7)
DISPLAY_nRST: U2.19(PD6/A16/BA0/PWMFI2)
DISPLAY_ON: U2.20(PD7/A17/BA1/TIOA8)
DISPLAY_TX: U2.17(PD4/A14/TXD3)
FAN_PWM: U2.144(PB25/RTS0/TIOA0)
FPGA_M0: U2.71(PA19/MCCK/PWMH1)
FPGA_M1: U2.72(PA20/MCCDA/PWML2)
FPGA_M2: U2.107(PA21/MCDA0/PWML0)
LEDSURGE: Q21.1(G) U2.140(PB14/CANTX1/PWMH2)
PGOOD_1V2: R199.2 U2.123(PB8/EMDC)
PGOOD_1V8: R209.2 U2.127(PB9/EMDIO)
PGOOD_3V3: R226.2 U2.129(PB11/UOTGID/A19)
PGOOD_VCCINT: R211.2 R254.1 U2.128(PB10/UOTGVBOF/A18)
PWRON: U2.68(PB27/NCS3/TIOB0)
PWRRESTART: SW6.1(IN) SW6.4(IN) U2.142(PB23/CTS2/SPI0_NPCS3/WKUP14)
QUIET_MODE: U2.13(PD0/A10/MCDA4)
SAM3PWRON: U2.83(PA4/TCLK1/NWAIT/AD2)
SAM3X_OT_POR: U2.103(PC30/A9/TCLK7)
SAM3X_VBUS_DETECT: U2.14(PD1/A11/MCDA5)
SAM_ERASE: J20.2 R70.1 U2.130(PC0/ERASE)
SAM_FPGA_CCLK: U2.143(PB24/SCK2/NCS2)
SAM_FPGA_CFG_CS: U2.77(PB16/TCLK5/PWML0/DAC1)
SAM_FPGA_CIPO: U2.92(PB21/RXD2/SPI0_NPCS2/AD14/WKUP13)
SAM_FPGA_COPI: U2.91(PB20/TXD2/SPI0_NPCS1/AD13)
SAM_JTAGSTRAP0: U2.87(PB13/TWCK1/PWMH1/AD9)
SAM_JTAGSTRAP1: U2.86(PB12/TWD1/PWMH0/AD8)
SAM_RXD0: R265.1A
SAM_RXD1: R265.3A
SAM_TCK: U2.28(PB28/TCK/SWCLK)
SAM_TDI: U2.29(PB29/TDI)
SAM_TDO: U2.30(PB30/TDO/TRACESWO)
SAM_TMS: U2.31(PB31/TMS/SWDIO)
SAM_TXD0: R265.2A
SAM_TXD1: R265.4A
SCL_1v8: U2.70(PA18/TWCK0/A20/WKUP9)
SDA_1v8: U2.9(PA17/TWD0/SPCK0)
SW_STATE: U2.1(PB26/CTS0/TCLK0/WKUP15)
TEMP_ALERT_N: U2.80(PA23/MCDA2/TCLK4/AD5)
USB_CLK0: R276.2
USB_SPI_CIPO: R309.1A
USB_SPI_COPI: R309.2A
USB_SPI_CS: R309.4A
USB_SPI_SCK: R309.3A
USBSPARE0: R163.1A
USBSPARE1: R163.2A
USBSPARE2: R163.3A
USBSPARE3: R163.4A
NetD3_A: D3.A R178.1
NetD3_K: D3.K Q20.3(D)
NetD7_A: D7.A R34.1
NetD7_K: D7.K Q16.3(D)
NetD8_A: D8.A R59.1
NetD8_K: D8.K Q17.3(D)
NetD9_A: D9.A R210.1
NetD9_K: D9.K Q19.3(D)
NetD23_A: D23.A R212.1
NetD23_K: D23.K Q18.3(D)
NetLED8_A: LED8.A R306.1
NetLED8_K: LED8.K Q21.3(D)
NetQ16_1: Q16.1(G) U2.23(PA0/CANTX0/PWML3)
NetQ17_1: Q17.1(G) U2.24(PA1/CANRX0/PCK0/WKUP0)
NetQ18_1: Q18.1(G) U2.85(PA2/TIOA1/NANDRDY/AD0)
NetQ19_1: Q19.1(G) U2.84(PA3/TIOB1/PWMFI1/AD1/WKUP1)
NetQ20_1: Q20.1(G) R254.2 R259.1
NetR31_1: R31.1 U2.32(PD10/NWR1/NBS1)
NetR152_2: R152.2 U2.82(PA6/TIOB2/NCS0/AD3)
NetR163_1B: R163.1B U2.132(PC21/A0/NBS0/PWML4)
NetR163_2B: R163.2B U2.133(PC22/A1/PWML5)
NetR163_3B: R163.3B U2.134(PC23/A2/PWML6)
NetR163_4B: R163.4B U2.135(PC24/A3/PWML7)
NetR173_2: R173.2 U2.55(PC1)
NetR265_1B: R265.1B U2.3(PA10/RXD0/DATRG/WKUP5)
NetR265_2B: R265.2B U2.4(PA11/TXD0/ADTRG/WKUP6)
NetR265_3B: R265.3B U2.5(PA12/RXD1/PWML1/WKUP7)
NetR265_4B: R265.4B U2.6(PA13/TXD1/PWMH2)
NetR267_1B: R267.1B U2.65(PC7/D5/PWMH2)
NetR267_2B: R267.2B U2.66(PC8/D6/PWML3)
NetR267_3B: R267.3B U2.67(PC9/D7/PWMH3)
NetR268_1B: R268.1B U2.93(PC11/D9/ERX2)
NetR268_2B: R268.2B U2.94(PC12/D10/ERX3)
NetR268_3B: R268.3B U2.95(PC13/D11/ECOL)
NetR268_4B: R268.4B U2.96(PC14/D12/ERXCK)
NetR269_1B: R269.1B U2.59(PC2/D0/PWML0)
NetR269_2B: R269.2B U2.60(PC3/D1/PWMH0)
NetR269_3B: R269.3B U2.63(PC5/D3/PWMH1)
NetR269_4B: R269.4B U2.64(PC6/D4/PWML2)
NetR272_1B: R272.1B U2.97(PC15/D13/ETX2)
NetR272_2B: R272.2B U2.98(PC16/D14/ETX3)
NetR272_3B: R272.3B U2.99(PC17/D15/ETXER)
NetR272_4B: R272.4B U2.100(PC18/NWR0/NWE/PWMH6)
NetR276_1: R276.1 U2.141(PB22/RTS2/PCK0)
NetR277_2: R277.2 U2.116(PC4/D2/PWML1)
NetR278_2: R278.2 U2.117(PC10/D8/ECRS)
NetR309_1B: R309.1B U2.108(PA25/SPI0_MISO/A18)
NetR309_2B: R309.2B U2.109(PA26/SPI0_MOSI/A19)
NetR309_3B: R309.3B U2.110(PA27/SPI0_SPCK/A20/WKUP10)
NetR309_4B: R309.4B U2.111(PA28/SPI0_NPCS0/PCK2/WKUP11)
NetR310_2: R310.2 U2.112(PA29/SPI0_NPCS1/NRD)

Not connected (* = marked no-connect by the designer): U2 2(PA9/UTXD/PWMH3) 7(PA14/RTS1/TK) 8(PA15/CTS1/TF/WKUP8) 15(PD2/A12/MCDA6) 18(PD5/A15/RXD3) 21(PD8/A21/NANDALE/TIOB8) 22(PD9/A22/NANDCLE/TCLK8) 25(PA5/TIOA2/PWMFI0/WKUP2) 26(PA7/TCLK2/NCS1/WKUP3) 27(PA8/URXD/PWMH0/WKUP4) 76(PB15/CANRX1/PWMH3/DAC0/WKUP12) 78(PA16/SPCK1/TD/AD7) 79(PA24/MCDA3/PCK1/AD6) 81(PA22/MCDA1/TCLK3/AD4) 101(PC19/NANDOE/PWMH5) 102(PC29/A8/TIOB7) 113(PB0/ETXCK/EREFCK) 114(PB1/ETXEN) 115(PB2/ETX0) 118(PB3/ETX1) 119(PB4/ECRSDV/ERXDV) 120(PB5/ERX0) 121(PB6/ERX1) 122(PB7/ERXER) 131(PC20/NANDWE/PWMH4) 136(PC25/A4/TIOA6) 137(PC26/A5/TIOB6) 138(PC27/A6/TCLK6) 139(PC28/A7/TIOA7)

### Notes on the sheet
- SAM3X CPU
- LEDs for over-temp of the FPGA.
- LEDs for SAM3X status.
- Title:
- Date:
- Rev:
- Time:
- Project:
- Sheet
- of
- License:
- Copyright © NewAE Technology Inc.
- Approved:
- NewAE.com
- File:

### Library data of the parts
D3 D8 D9 = LEDCHIP_0603_GREEN: as D19 on sheet CW340_PSU_VCCAUX; Part Number: LEDCHIP_0603_GREEN; Pin Count: 2; Supplier 1: Digi-Key; Supplier Part Number 1: 754-1116-1-ND; Mounting Technology: SMT; Component Kind: Standard; Component Type: Standard
D7 LED8 = LEDCHIP_0603_RED: Chip LED, Red; Manufacture 1: Kingbright; Manufacture Part Number 1: APT1608SRCPRV; Component Group: Optical; PP Material Stack: 15; PP Rotation: -90; Part Number: LEDCHIP_0603_RED; Pin Count: 2; Supplier 1: Digi-Key; Supplier Part Number 1: 754-1122-1-ND; Mounting Technology: SMT; Component Kind: Standard; Component Type: Standard
D23 = LEDCHIP_0603_BLUE: Chip LED, Blue; Manufacture 1: Kingbright; Manufacture Part Number 1: APT1608QBC/D; Component Group: Optical; Part Number: LEDCHIP_0603_BLUE; Pin Count: 2; Mounting Technology: SMT; Component Kind: Standard; Component Type: Standard
J20 = 2_PIN_JUMPER: as J21 on sheet CW340_USBHUB; Part Number: 2_PIN_JUMPER; Pin Count: 2; Supplier 1: Digi-Key; Supplier Part Number 1: 952-2262-ND; Mounting Technology: Through-hole; RoHS: Yes; Component Kind: Standard; Component Type: Standard; PP Rotation: 0
Q16-Q21 = DMN3200U-7: MOSFET N-CH 30V 2.2A SOT23-3; Manufacture 1: Diodes Inc.; Rated Power: 3A; PP Material Stack: 0; Part Number: DMN3200U-7; Component Group: MOSFET; Footprint: SOT23; Manufacture Part Number 1: DMN3200U-7; Pin Count: 3; Supplier 1: Digi-Key; Supplier Part Number 1: DMN3200U-7DICT-ND; Rated Voltage: 30V; Mounting Technology: SMT; RoHS: Yes; Component Kind: Standard; Component Type: Standard; PP Rotation: 0
R31 R152 R173 R277 R278 R310 = RCHIP-33R-0402: 33R res, 0402, 1%, 1/16W; Manufacture 1: Yageo; Manufacture Part Number 1: RC0402FR-0733RL; Component Group: Resistor; Case-EIA: 0402; Case-Metric: 1005; Rated Power: 0.063W; Rated Voltage: 75VDC; Part Number: RCHIP-33R-0402; Footprint: 0402; Pin Count: 2; Supplier 1: Digi-Key; Supplier Part Number 1: 311-33.0LRCT-ND; Value: 33R; Tolerance: 1%; Mounting Technology: SMT; Temperature Range: -55C to 155C; Component Kind: Standard; Component Type: Standard
R34 = RCHIP-220R-0603: 220R res, 0603, 1%, 1/10W; Manufacture 1: Yageo; Manufacture Part Number 1: RC0603FR-07220RL; Component Group: Resistor; Case-EIA: 0603; Case-Metric: 1608; Rated Power: 0.1W; Rated Voltage: 75VDC; Part Number: RCHIP-220R-0603; Footprint: 0603; Pin Count: 2; Supplier 1: Digi-Key; Supplier Part Number 1: 311-220HRCT-ND; Value: 220R; Tolerance: 1%; Mounting Technology: SMT; Temperature Range: -55C to 155C; Component Kind: Standard; Component Type: Standard
R59 R178 R210 R212 R306 = RCHIP-330R-0603: 330R res, 0603, 1%, 1/10W; Manufacture 1: Yageo; Manufacture Part Number 1: RC0603FR-07330RL; Component Group: Resistor; Case-EIA: 0603; Case-Metric: 1608; Rated Power: 0.1W; Rated Voltage: 75VDC; Part Number: RCHIP-330R-0603; Footprint: 0603; Pin Count: 2; Supplier 1: Digi-Key; Supplier Part Number 1: 311-330HRCT-ND; Value: 330R; Tolerance: 1%; Mounting Technology: SMT; Temperature Range: -55C to 155C; Component Kind: Standard; Component Type: Standard
R70 = RCHIP-10K-0402: 10k res, 0402, 1%, 1/16W; Manufacture 1: Yageo; Manufacture Part Number 1: RC0402FR-0710KL; Component Group: Resistor; Case-EIA: 0402; Case-Metric: 1005; Rated Power: 0.063W; Rated Voltage: 75VDC; Part Number: RCHIP-10K-0402; Footprint: 0402; Pin Count: 2; Supplier 1: Digi-Key; Supplier Part Number 1: 311-10.0KLRCT-ND; Value: 10k; Tolerance: 1%; Mounting Technology: SMT; Temperature Range: -55C to 155C; Component Kind: Standard; Component Type: Standard
R163 R265 R267-R269 R272 R309 = 741C083330JP: 33-ohm, 0.5mm res array; Manufacture 1: CTS; Component Group: Resistor; PP Material Stack: 0; Part Number: 741C083330JP; Manufacture Part Number 1: 741C083330JP; Pin Count: 8; Supplier 1: Digi-Key; Mounting Technology: SMT; Component Kind: Standard; Component Type: Standard; PP Rotation: 0; PP Rotation1: 0; Supplier Part Number 1: 741C083330JPCT-ND
R199 R209 R211 R226 R254 R259 = RCHIP-100K-0603: as R149 on sheet CW340_INPUT_POWER; Part Number: RCHIP-100K-0603; Footprint: 0603; Pin Count: 2; Supplier 1: Digi-Key; Supplier Part Number 1: 311-100KHRCT-ND; Value: 100k; Tolerance: 1%; Mounting Technology: SMT; Temperature Range: -55C to 155C; Component Kind: Standard; Component Type: Standard
R276 = RCHIP-22R-0402: 22R res, 0402, 1%, 1/16W; Manufacture 1: Yageo; Manufacture Part Number 1: RC0402FR-0722RL; Component Group: Resistor; Case-EIA: 0402; Case-Metric: 1005; Rated Power: 0.063W; Rated Voltage: 75VDC; Part Number: RCHIP-22R-0402; Footprint: 0402; Pin Count: 2; Supplier 1: Digi-Key; Supplier Part Number 1: 311-22.0LRCT-ND; Value: 22R; Tolerance: 1%; Mounting Technology: SMT; Temperature Range: -55C to 155C; Component Kind: Standard; Component Type: Standard
SW6 = TACTSW-KSC243J: SWITCH TACTILE SPST-NO 0.01A 32V; Manufacture 1: C&K; Part Number: TACTSW-KSC243J; Component Group: Switch; Manufacture Part Number 1: KSC243JLFG; Pin Count: 4; Supplier 1: Digi-Key; Supplier Part Number 1: 401-1764-1-ND; Mounting Technology: SMT; RoHS: Yes; Component Kind: Standard; Component Type: Standard
U2 = CMP-0076-00188-1: SAM3X ARM Cortex-M3 Flash-based Microcontroller, 512 KB Flash, 96 KB SRAM, 103 User I/Os, 1.62 to 3.6 V, -40 to 85 degC, 144-Pin LQFP, RoHS; Manufacturer: Atmel; UART: 5; Max. Operating Freq.: 84 MHz; ADC Resolution: 12 bits; Flash: 512 Kbytes; ADC Channels: 16; SRAM: 96 Kbytes; Max I/O Pins: 103; DAC Channels: 2; SPI: 4; # of Touch Channels: 32; Mounting Technology: Surface Mount; Operating Voltage: 1.62 to 3.6 V; ComponentLink2URL: http://www.atmel.com/Images/doc11057.pdf; CAN: 2; ComponentLink1Description: Manufacturer URL; RoHS: TRUE; PartNumber: ATSAM3X8EA-AU; Temp. Range: -40 to 85 degC; PackageVersion: 11057B; PackageDescription: 100-Pin Quad Flat Package, Body 20 x 20 mm, Pitch 0.5 mm; ComponentLink2Description: Datasheet; DatasheetVersion: 11057B; ComponentLink1URL: http://www.atmel.com/; ComponentLink3Description: Package Specification; ComponentLink3URL: http://www.atmel.com/Images/doc11057.pdf; PackageReference: LQFP-144

## Sheet CW340_SAM3X_PWR.SchDoc: MCU Power
size Letter; Organization: NewAE Technology Inc.; Address1: 1083 Queen St., Suite 196; Address2: Halifax; Address3: NS; Address4: Canada B3H 0B2; DocumentNumber: .; Revision: .; SheetNumber: 8; SheetTotal: 31; SheetApproved: YES
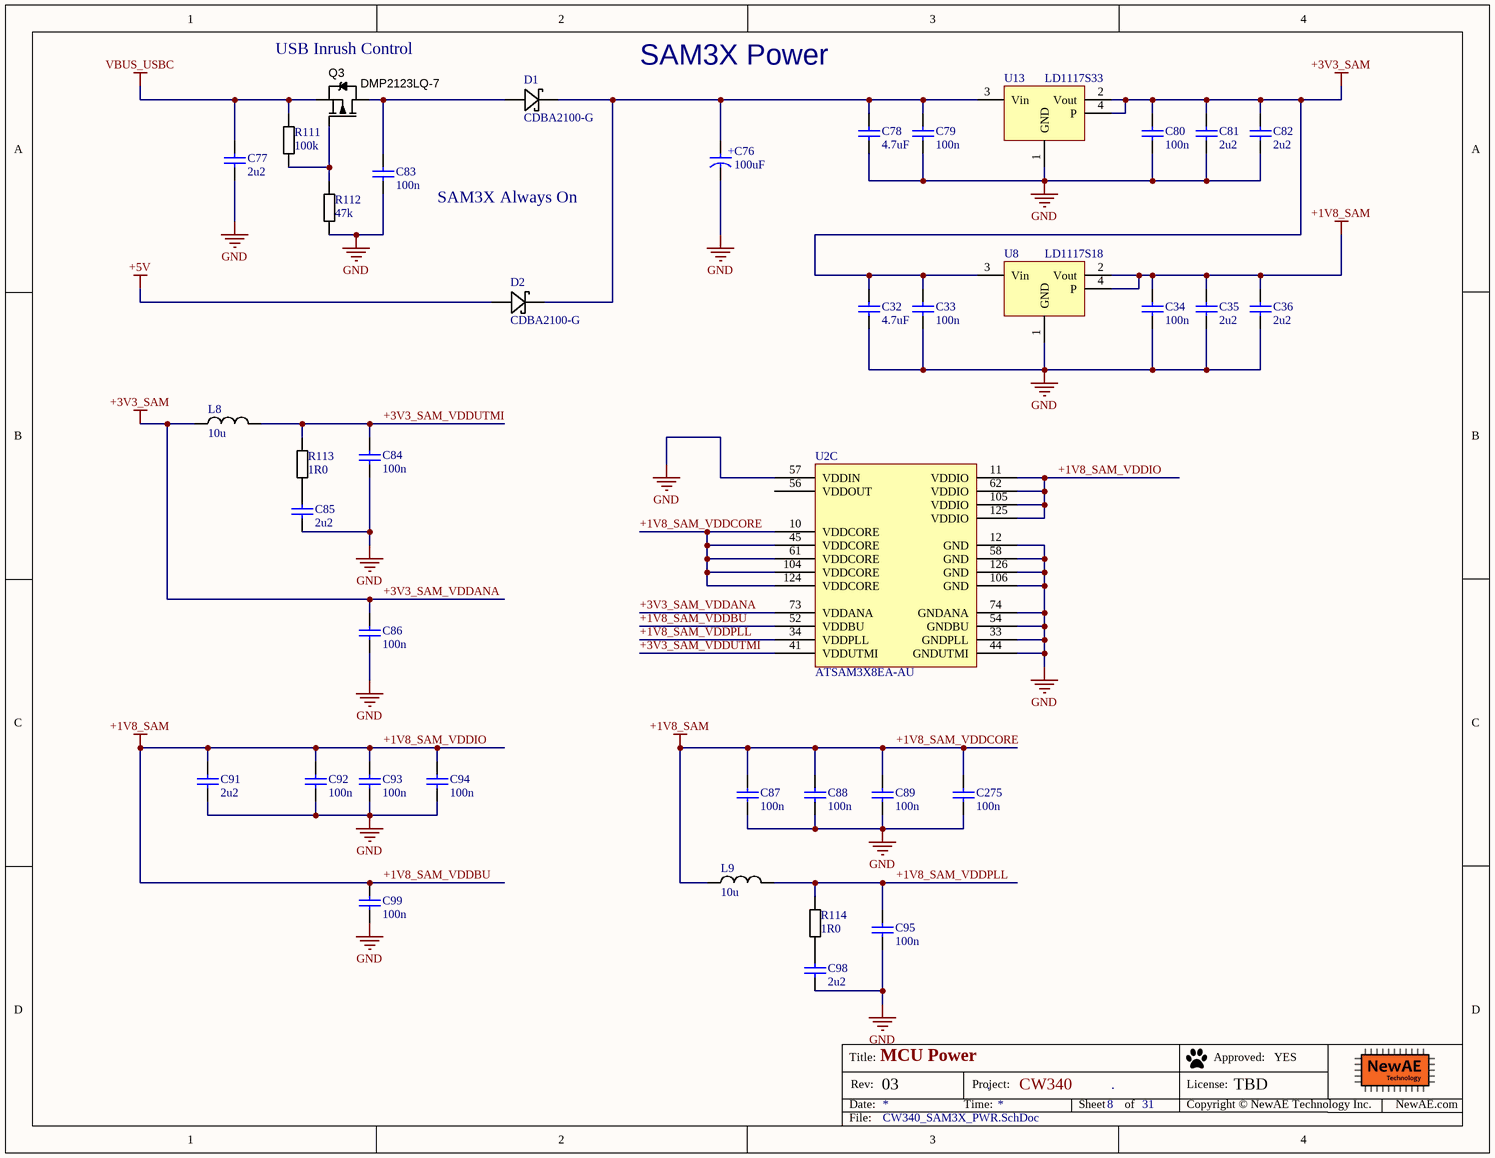
[diagram p12: CW340_SAM3X_PWR.SchDoc]

### Parts
C32  4.7uF  [CAPC0805_M]
C33  100n  [CAPC0402_M]
C34  100n  [CAPC0402_M]
C35  2u2  [CAPC0603_M]
C36  2u2  [CAPC0603_M]
C76  100uF  [CAP_AL_D6.3]
C77  2u2  [CAPC0603_M]
C78  4.7uF  [CAPC0805_M]
C79  100n  [CAPC0402_M]
C80  100n  [CAPC0402_M]
C81  2u2  [CAPC0603_M]
C82  2u2  [CAPC0603_M]
C83  100n  [CAPC0402_M]
C84  100n  [CAPC0402_M]
C85  2u2  [CAPC0603_M]
C86  100n  [CAPC0402_M]
C87  100n  [CAPC0402_M]
C88  100n  [CAPC0402_M]
C89  100n  [CAPC0402_M]
C91  2u2  [CAPC0603_M]
C92  100n  [CAPC0402_M]
C93  100n  [CAPC0402_M]
C94  100n  [CAPC0402_M]
C95  100n  [CAPC0402_M]
C98  2u2  [CAPC0603_M]
C99  100n  [CAPC0402_M]
C275  100n  [CAPC0402_M]
D1  CDBA2100-G  [DO-214AC]
D2  CDBA2100-G  [DO-214AC]
L8  10u  [IND_0603]
L9  10u  [IND_0603]
Q3  DMP2123LQ-7  [SOT95P245X110-3M]
R111  100k  [RESC1608X55N]
R112  47k  [RESC1608X55N]
R113  1R0  [RESC1608X55N]
R114  1R0  [RESC1608X55N]
U2  ATSAM3X8EA-AU  [LQFP144_L]  (part C of 3)
U8  LD1117S18  [SOT-223]
U13  LD1117S33  [SOT-223]

### Nets
+1V8_SAM_VDDBU: C34.1 C35.1 C36.1 C87.1 C88.1 C89.1 C91.1 C92.1 C93.1 C94.1 C99.1 C275.1 L9.1 U2.10(VDDCORE) U2.11(VDDIO) U2.45(VDDCORE) U2.52(VDDBU) U2.61(VDDCORE) U2.62(VDDIO) U2.104(VDDCORE) U2.105(VDDIO) U2.124(VDDCORE) U2.125(VDDIO) U8.2(Vout) U8.4(P)  [also labelled +1V8_SAM, +1V8_SAM_VDDCORE, +1V8_SAM_VDDIO]
+3V3_SAM_VDDANA: C32.1 C33.1 C80.1 C81.1 C82.1 C86.1 L8.1 U2.73(VDDANA) U8.3(Vin) U13.2(Vout) U13.4(P)  [also labelled +3V3_SAM]
+5V: D2.A
GND: C32.2 C33.2 C34.2 C35.2 C36.2 C76.2 C77.2 C78.2 C79.2 C80.2 C81.2 C82.2 C83.2 C84.2 C85.2 C86.2 C87.2 C88.2 C89.2 C91.2 C92.2 C93.2 C94.2 C95.2 C98.2 C99.2 C275.2 R112.2 U2.12(GND) U2.33(GNDPLL) U2.44(GNDUTMI) U2.54(GNDBU) U2.57(VDDIN) U2.58(GND) U2.74(GNDANA) U2.106(GND) U2.126(GND) U8.1(GND) U13.1(GND)
VBUS_USBC: C77.1 Q3.2(S) R111.1  [project net VUSB_USBC]
+1V8_SAM_VDDPLL: C95.1 L9.2 R114.1 U2.34(VDDPLL)
+3V3_SAM_VDDUTMI: C84.1 L8.2 R113.1 U2.41(VDDUTMI)
NetC76_1: C76.1 C78.1 C79.1 D1.K D2.K U13.3(Vin)
NetC83_1: C83.1 D1.A Q3.3(D)
NetC85_1: C85.1 R113.2
NetC98_1: C98.1 R114.2
NetQ3_1: Q3.1(G) R111.2 R112.1

Not connected (* = marked no-connect by the designer): U2 56(VDDOUT)

### Notes on the sheet
- (near Q3) USB Inrush Control
- SAM3X Power
- SAM3X Always On
- Title:
- Date:
- Rev:
- Time:
- Project:
- Sheet
- of
- License:
- Copyright © NewAE Technology Inc.
- Approved:
- NewAE.com
- File:
- (in symbol Cap_35v_100uF) +

### Library data of the parts
C32 C78 = CCHIP-4u7-0805-35V: 4u7, 35V, 0805, Ceramic; Manufacture 1: Murata; Manufacture Part Number 1: GRT21BC8YA475KE13L; Component Group: Capacitor; Case-EIA: 0805; Case-Metric: 1608; Rated Voltage: 35VDC; Tolerance: 10%; Part Number: CCHIP-4u7-0805-35V; Footprint: 0805; Pin Count: 2; Supplier 1: Digi-Key; Supplier Part Number 1: 490-12361-1-ND; Value: 4.7uF; Mounting Technology: SMT; Temperature Range: -55C to 85C; Component Kind: Standard; Component Type: Standard
C33 C34 C79 C80 C83 C84 C86-C89 C92-C95 C99 C275 = CCHIP-100n-0402: 100n, 0402; Manufacture Part Number 1: CGA2B3X7R1V104K050BB; Component Group: Capacitor; Case-EIA: 0402; Part Number: CCHIP-100n-0402; Footprint: 0402; Pin Count: 2; Value: 100n; Mounting Technology: SMT; Component Kind: Standard; Component Type: Standard; Supplier 1: Digi-Key; Supplier Part Number 1: 445-6901-1-ND
C35 C36 C77 C81 C82 C85 C91 C98 = CCHIP-2u2-0603: 2u2, 0603; Manufacture 1: Samsung; Manufacture Part Number 1: CL10B225KP8NNNC; Component Group: Capacitor; Case-EIA: 0603; Case-Metric: 1608; Rated Voltage: 10VDC; Part Number: CCHIP-2u2-0603; Footprint: 0603; Pin Count: 2; Supplier 1: Digi-Key; Supplier Part Number 1: 1276-1134-1-ND; Value: 2u2; Mounting Technology: SMT; Component Kind: Standard; Component Type: Standard
C76 = Cap_35v_100uF: CAP ALUM 100UF 20% 35V RADIAL; Manufacture 1: Panasonic Electronic Components; Manufacture Part Number 1: ECA-1VM101; Component Group: Capacitor; PP Material Stack: 0; Part Number: Cap_35v_100uF; Pin Count: 2; Supplier 1: Digi-Key; Supplier Part Number 1: P5165-ND; Value: 100uF; Mounting Technology: Through-hole; RoHS: Yes; Component Kind: Standard; Component Type: Standard; PP Rotation: 0
D1 D2 = CDBA2100-G: Diode Schottky, 100V, 2A; Manufacture 1: Comchip Technology; Part Number: CDBA2100-G; Component Group: Diode; Footprint: SMA; Manufacture Part Number 1: CDBA2100-G; Pin Count: 2; Supplier 1: Digi-Key; Supplier Part Number 1: 641-1094-1-ND; Mounting Technology: SMT; RoHS: Yes; Component Kind: Standard; Component Type: Standard
L8 L9 = LCHIP-10U-0603: FIXED IND 10UH 50MA 900 MOHM SMD; Manufacture 1: Murata Electronics North America; Manufacture Part Number 1: LQM18FN100M00D; Component Group: Inductor; Case-EIA: 0603; Case-Metric: 1608; Tolerance: ±20%; PP Material Stack: 0; Part Number: LCHIP-10U-0603; Footprint: 0603; Pin Count: 2; Supplier 1: Digi-Key; Supplier Part Number 1: 490-4025-1-ND; Value: 10u; Mounting Technology: SMT; Component Kind: Standard; Component Type: Standard; PP Rotation: 0
Q3 = DMP2123LQ-7: P-Channel, 3A, Logic Level; Manufacture 1: Diodes Inc.; Component Group: MOSFET; Part Number: DMP2123LQ-7; Footprint: SOT23; Manufacture Part Number 1: DMP2123LQ-7; Pin Count: 3; Supplier 1: Digi-Key; Supplier Part Number 1: DMP2123LQ-7DICT-ND; Mounting Technology: SMT; Component Kind: Standard; Component Type: Standard
R111 = RCHIP-100K-0603: 100k res, 0603, 1%, 1/10W; Manufacture 1: Yageo; Manufacture Part Number 1: RC0603FR-07100KL; Component Group: Resistor; Case-EIA: 0603; Case-Metric: 1608; Rated Power: 0.1W; Rated Voltage: 75VDC; Part Number: RCHIP-100K-0603; Footprint: 0603; Pin Count: 2; Supplier 1: Digi-Key; Supplier Part Number 1: 311-100KHRCT-ND; Value: 100k; Tolerance: 1%; Mounting Technology: SMT; Temperature Range: -55C to 155C; Component Kind: Standard; Component Type: Standard
R112 = RCHIP-47K-0603: 47k res, 0603, 1%, 1/10W; Manufacture 1: Yageo; Manufacture Part Number 1: RC0603FR-0747KL; Component Group: Resistor; Case-EIA: 0603; Case-Metric: 1608; Rated Power: 0.1W; Rated Voltage: 75VDC; Part Number: RCHIP-47K-0603; Footprint: 0603; Pin Count: 2; Supplier 1: Digi-Key; Supplier Part Number 1: 311-47.0KHRCT-ND; Value: 47k; Tolerance: 1%; Mounting Technology: SMT; Temperature Range: -55C to 155C; Component Kind: Standard; Component Type: Standard
R113 R114 = RCHIP-1R0-0603: 1R0 res, 0603, 1%, 1/10W; Manufacture 1: Yageo; Manufacture Part Number 1: RC0603FR-071RL; Component Group: Resistor; Case-EIA: 0603; Case-Metric: 1608; Rated Power: 0.1W; Rated Voltage: 75VDC; Part Number: RCHIP-1R0-0603; Footprint: 0603; Pin Count: 2; Supplier 1: Digi-Key; Supplier Part Number 1: 311-1.00HRCT-ND; Value: 1R0; Tolerance: 1%; Mounting Technology: SMT; Temperature Range: -55C to 155C; Component Kind: Standard; Component Type: Standard
U2 = CMP-0076-00188-1: SAM3X ARM Cortex-M3 Flash-based Microcontroller, 512 KB Flash, 96 KB SRAM, 103 User I/Os, 1.62 to 3.6 V, -40 to 85 degC, 144-Pin LQFP, RoHS; Manufacturer: Atmel; UART: 5; Max. Operating Freq.: 84 MHz; ADC Resolution: 12 bits; Flash: 512 Kbytes; ADC Channels: 16; SRAM: 96 Kbytes; Max I/O Pins: 103; DAC Channels: 2; SPI: 4; # of Touch Channels: 32; Mounting Technology: Surface Mount; Operating Voltage: 1.62 to 3.6 V; ComponentLink2URL: http://www.atmel.com/Images/doc11057.pdf; CAN: 2; ComponentLink1Description: Manufacturer URL; RoHS: TRUE; PartNumber: ATSAM3X8EA-AU; Temp. Range: -40 to 85 degC; PackageVersion: 11057B; PackageDescription: 100-Pin Quad Flat Package, Body 20 x 20 mm, Pitch 0.5 mm; ComponentLink2Description: Datasheet; DatasheetVersion: 11057B; ComponentLink1URL: http://www.atmel.com/; ComponentLink3Description: Package Specification; ComponentLink3URL: http://www.atmel.com/Images/doc11057.pdf; PackageReference: LQFP-144
U8 = LD1117S18: IC REG LIN POS 1.8V 800MA SOT223; Manufacture 1: STMicroelectronics; Manufacture Part Number 1: LD1117S18TR; Component Group: Analog IC; Rated Voltage: 15V; PP Material Stack: 0; Part Number: LD1117S18; Pin Count: 3; Supplier 1: Digi-Key; Supplier Part Number 1: 497-7308-1-ND; Mounting Technology: SMT; RoHS: Yes; Component Kind: Standard; Component Type: Standard; PP Rotation: 0
U13 = LD1117S33: IC REG LIN POS 3.3V 800MA SOT223; Manufacture 1: STMicroelectronics; Manufacture Part Number 1: LD1117S33TR; Component Group: Analog IC; Rated Voltage: 15V; PP Material Stack: 0; Part Number: LD1117S33; Pin Count: 3; Supplier 1: Digi-Key; Supplier Part Number 1: 497-1242-1-ND; Mounting Technology: SMT; RoHS: Yes; Component Kind: Standard; Component Type: Standard; PP Rotation: 0